# Altium schematic sheet Battery Power.SchDoc
size A4
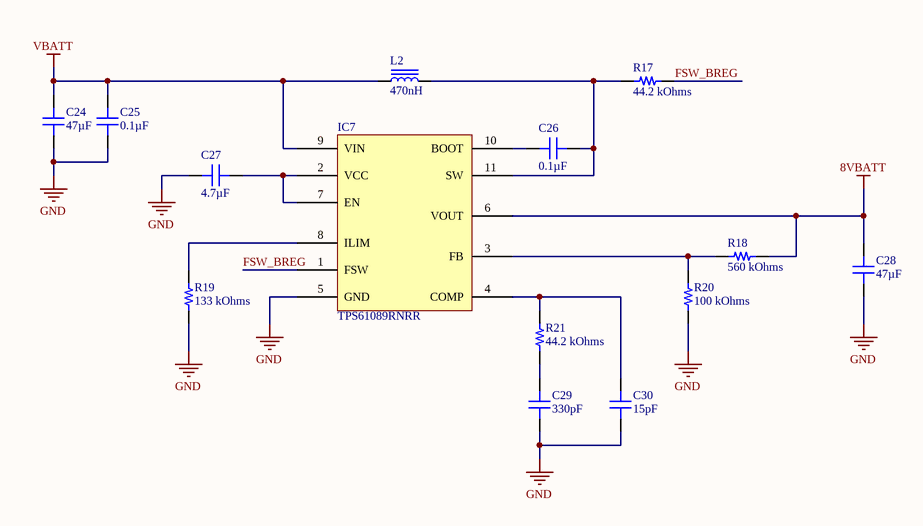
[diagram p0: Battery Power.SchDoc]

## Parts
C24  47µF  [CAP 1210_3225 - 2.8MM]
C25  0.1µF  [CAP 0201_0603]
C26  0.1µF  [CAP 0201_0603]
C27  4.7µF  [CAP 0402_1005]
C28  47µF  [CAP 1210_3225 - 2.8MM]
C29  330pF  [CAP 0201_0603]
C30  15pF  [CAP 0201_0603]
IC7  TPS61089RNRR  [TI VQFN-11 2.5x2.1 RNR]
L2  470nH  [BOURNS SRP5030T]
R17  44.2 kOhms  [RES 0201_0603]
R18  560 kOhms  [RES 0201_0603]
R19  133 kOhms  [RES 0201_0603]
R20  100 kOhms  [RES 0201_0603]
R21  44.2 kOhms  [RES 0201_0603]

## Nets
8VBATT: C28.2 IC7.6(VOUT) R18.1
GND: C24.1 C25.1 C27.1 C28.1 C29.1 C30.1 IC7.5(GND) R19.1 R20.1
VBATT: C24.2 C25.2 IC7.9(VIN) L2.1
FSW_BREG: IC7.1(FSW) R17.2
NetC26_1: C26.1 IC7.11(SW) L2.2 R17.1
NetC26_2: C26.2 IC7.10(BOOT)
NetC27_2: C27.2 IC7.2(VCC) IC7.7(EN)
NetC29_2: C29.2 R21.1
NetC30_2: C30.2 IC7.4(COMP) R21.2
NetIC7_3: IC7.3(FB) R18.2 R20.2
NetIC7_8: IC7.8(ILIM) R19.2

## Notes on the sheet
- Title
- Size:
- Date:
- A4
- Number:
- Time:
- Revision:
- Sheet
- of
- File:

## Library data of the parts
C24 = LMK325B7476MM-PR: CAP CER 47UF 10V X7R 1210; Manufacturer: Taiyo Yuden; Tolerance: ±20%; Part Number: LMK325B7476MM-PR; Value: 47µF; Applications: General Purpose; Capacitance: 47µF; ComponentLink1Description: Datasheet; ComponentLink1URL: https://www.yuden.co.jp/productdata/catalog/mlcc01_e.pdf; ComponentLink2Description: DigiKey Link; ComponentLink2URL: http://digikey.com/product-detail/en/taiyo-yuden/LMK325B7476MM-PR/587-5922-1-ND/7675042; Device Package: 1210 (3225 Metric); LastUpdated: 21/01/2020 00:30:21; Lifecycle Status: Active; Minimum Order: 1; Mounting Type: Surface Mount, MLCC; Operating Temperature: -55°C ~ 125°C; Package / Case: 1210 (3225 Metric); Packaging: TapeAndReel; PartId: 24091; Part Status: Active; Price: 0.28; Series: M; Size / Dimension: 0.126" L x 0.098" W (3.20mm x 2.50mm); Supplier 1: DigiKey; Supplier Part Number 1: 587-5922-1-ND; Temperature Coefficient: X7R; Thickness (Max): 0.106" (2.70mm); Voltage - Rated: 10V
C25 C26 = GRM033R61C104ME84D: CAP CER 0.1UF 16V X5R 0201; Manufacturer: Murata Electronics; Tolerance: ±20%; Part Number: GRM033R61C104ME84D; Value: 0.1µF; Applications: General Purpose; Capacitance: 0.1µF; ComponentLink1Description: Datasheet; ComponentLink1URL: https://search.murata.co.jp/Ceramy/image/img/A01X/G101/ENG/GRM033R61C104ME84-01.pdf; ComponentLink2Description: DigiKey Link; ComponentLink2URL: http://digikey.com/product-detail/en/murata-electronics/GRM033R61C104ME84D/490-9986-1-ND/5026291; Device Package: 0201 (0603 Metric); LastUpdated: 21/01/2020 00:00:12; Lifecycle Status: Active; Minimum Order: 1; Mounting Type: Surface Mount, MLCC; Operating Temperature: -55°C ~ 85°C; Package / Case: 0201 (0603 Metric); Packaging: TapeAndReel; PartId: 1522; Part Status: Active; Price: 0.01; Series: GRM; Size / Dimension: 0.024" L x 0.012" W (0.60mm x 0.30mm); Supplier 1: DigiKey; Supplier Part Number 1: 490-9986-1-ND; Temperature Coefficient: X5R; Thickness (Max): 0.013" (0.33mm); Voltage - Rated: 16V
C27 = CL05A475KP5NRNC: CAP CER 4.7UF 10V X5R 0402; Manufacturer: Samsung Electro-Mechanics; Tolerance: ±10%; Part Number: CL05A475KP5NRNC; Value: 4.7µF; Applications: General Purpose; Capacitance: 4.7µF; ComponentLink1Description: Datasheet; ComponentLink1URL: http://www.samsungsem.com/kr/support/product-search/mlcc/CL05A475KP5NRNC.jsp; ComponentLink2Description: DigiKey Link; ComponentLink2URL: http://digikey.com/product-detail/en/samsung-electro-mechanics/CL05A475KP5NRNC/1276-1480-1-ND/3889566; Device Package: 0402 (1005 Metric); LastUpdated: 01/04/2020 23:57:03; Lifecycle Status: Active; Minimum Order: 1; Mounting Type: Surface Mount, MLCC; Operating Temperature: -55°C ~ 85°C; Package / Case: 0402 (1005 Metric); Packaging: TapeAndReel; PartId: 2191; Part Status: Active; Price: 0.08; Series: CL; Size / Dimension: 0.039" L x 0.020" W (1.00mm x 0.50mm); Supplier 1: DigiKey; Supplier Part Number 1: 1276-1480-1-ND; Temperature Coefficient: X5R; Thickness (Max): 0.022" (0.55mm); Voltage - Rated: 10V
C28 = C1210C476M4PACTU: CAP CER 47UF 16V X5R 1210; Manufacturer: KEMET; Tolerance: ±20%; Part Number: C1210C476M4PACTU; Value: 47µF; Applications: General Purpose; Capacitance: 47µF; ComponentLink1Description: Datasheet; ComponentLink1URL: https://api.kemet.com/component-edge/download/datasheet/C1210C476M4PACTU.pdf; ComponentLink2Description: DigiKey Link; ComponentLink2URL: http://digikey.com/product-detail/en/kemet/C1210C476M4PACTU/399-5514-1-ND/1950692; Device Package: 1210 (3225 Metric); LastUpdated: 21/01/2020 00:30:39; Lifecycle Status: Active; Minimum Order: 1; Mounting Type: Surface Mount, MLCC; Operating Temperature: -55°C ~ 85°C; Package / Case: 1210 (3225 Metric); Packaging: TapeAndReel; PartId: 23816; Part Status: Active; Price: 0.38; Series: SMD Comm X5R; Size / Dimension: 0.126" L x 0.098" W (3.20mm x 2.50mm); Supplier 1: DigiKey; Supplier Part Number 1: 399-5514-1-ND; Temperature Coefficient: X5R; Thickness (Max): 0.110" (2.80mm); Voltage - Rated: 16V
C29 = CL03B331KA3NNNC: CAP CER 330PF 25V X7R 0201; Manufacturer: Samsung Electro-Mechanics; Tolerance: ±10%; Part Number: CL03B331KA3NNNC; Value: 330pF; Applications: General Purpose; Capacitance: 330pF; ComponentLink1Description: Datasheet; ComponentLink1URL: http://www.samsungsem.com/kr/support/product-search/mlcc/CL03B331KA3NNNC.jsp; ComponentLink2Description: DigiKey Link; ComponentLink2URL: http://digikey.com/product-detail/en/samsung-electro-mechanics/CL03B331KA3NNNC/1276-1351-1-ND/3889437; Device Package: 0201 (0603 Metric); LastUpdated: 21/01/2020 00:00:16; Lifecycle Status: Active; Minimum Order: 1; Mounting Type: Surface Mount, MLCC; Operating Temperature: -55°C ~ 125°C; Package / Case: 0201 (0603 Metric); Packaging: TapeAndReel; PartId: 781; Part Status: Active; Price: 0.01; Series: CL; Size / Dimension: 0.024" L x 0.012" W (0.60mm x 0.30mm); Supplier 1: DigiKey; Supplier Part Number 1: 1276-1351-1-ND; Temperature Coefficient: X7R; Thickness (Max): 0.013" (0.33mm); Voltage - Rated: 25V
C30 = CGA1A2C0G1E150J030BA: CAP CER 15PF 25V C0G 0201; Manufacturer: TDK Corporation; Temperature Coefficient: C0G, NP0; Tolerance: ±5%; Part Number: CGA1A2C0G1E150J030BA; Value: 15pF; Applications: Automotive; Capacitance: 15pF; ComponentLink1Description: Datasheet; ComponentLink1URL: https://product.tdk.com/info/en/catalog/datasheets/mlcc_automotive_general_en.pdf?ref_disty=digikey; ComponentLink2Description: DigiKey Link; ComponentLink2URL: http://digikey.com/product-detail/en/tdk-corporation/CGA1A2C0G1E150J030BA/445-9034-1-ND/3648614; Device Package: 0201 (0603 Metric); LastUpdated: 21/01/2020 00:00:11; Lifecycle Status: Active; Minimum Order: 1; Mounting Type: Surface Mount, MLCC; Operating Temperature: -55°C ~ 125°C; Package / Case: 0201 (0603 Metric); Packaging: TapeAndReel; PartId: 1675; Part Status: Active; Price: 0.01; Ratings: AEC-Q200; Series: CGA; Size / Dimension: 0.024" L x 0.012" W (0.60mm x 0.30mm); Supplier 1: DigiKey; Supplier Part Number 1: 445-9034-1-ND; Thickness (Max): 0.013" (0.33mm); Voltage - Rated: 25V
IC7 = TPS61089RNRR: IC REG BOOST ADJ 7A 11VQFN; Manufacturer: Texas Instruments; Frequency - Switching: 200kHz ~ 2.2MHz; Function: Step-Up; Number of Outputs: 1; Output Configuration: Positive; Output Type: Adjustable; Synchronous Rectifier: Yes; Voltage - Input (Max): 12V; Voltage - Input (Min): 2.7V; Voltage - Output (Max): 12.6V; Voltage - Output (Min/Fixed): 4.5V; Part Number: TPS61089RNRR; ComponentLink1Description: Datasheet; ComponentLink1URL: http://www.ti.com/general/docs/suppproductinfo.tsp?distId=10&gotoUrl=http%3A%2F%2Fwww.ti.com%2Flit%2Fgpn%2Ftps61089; ComponentLink2Description: DigiKey Link; ComponentLink2URL: http://digikey.com/product-detail/en/texas-instruments/TPS61089RNRR/296-47295-1-ND/7688305; Current - Output: 7A; Device Package: 11-VFQFN; LastUpdated: 05/04/2020 02:30:28; Lifecycle Status: Active; Minimum Order: 1; Mounting Type: Surface Mount; Operating Temperature: -40°C ~ 125°C (TJ); Package / Case: 11-VFQFN; Packaging: TapeAndReel; Part Status: Active; Price: 1.26; Series: -; Supplier 1: DigiKey; Supplier Part Number 1: 296-47295-1-ND; Supplier Device Package: 11-VQFN-HR (2.5x2); Topology: Boost
L2 = SRP5030T-R47M: FIXED IND 470NH 12A 7.4 MOHM SMD; Manufacturer: Bourns Inc.; Current - Saturation: 16A; DC Resistance (DCR): 7.4mOhm Max; Inductance Frequency - Test: 100kHz; Material - Core: Iron Powder; Shielding: Shielded; Tolerance: ±20%; Type: Wirewound; Part Number: SRP5030T-R47M; ComponentLink1Description: Datasheet; ComponentLink1URL: https://www.bourns.com/docs/Product-Datasheets/SRP5030T.pdf; ComponentLink2Description: DigiKey Link; ComponentLink2URL: http://digikey.com/product-detail/en/bourns-inc/SRP5030T-R47M/SRP5030T-R47MCT-ND/3986019; Current Rating (Amps): 12A; Device Package: Nonstandard; Height - Seated (Max): 0.118" (3.00mm); Inductance: 470nH; LastUpdated: 21/01/2020 03:25:23; Lifecycle Status: Active; Minimum Order: 1; Mounting Type: Surface Mount; Operating Temperature: -40°C ~ 125°C; Package / Case: Nonstandard; Packaging: TapeAndReel; PartId: 5; Part Status: Active; Price: 0.66; Series: SRP5030T; Size / Dimension: 0.224" L x 0.205" W (5.70mm x 5.20mm); Supplier 1: DigiKey; Supplier Part Number 1: SRP5030T-R47MCT-ND; Value: 470nH
R17 R21 = ERJ-1GNF4422C: RES SMD 44.2K OHM 1% 1/20W 0201; Manufacturer: Panasonic Electronic Components; Power (Watts): 0.05W, 1/20W; Temperature Coefficient: ±200ppm/°C; Part Number: ERJ-1GNF4422C; Value: 44.2 kOhms; ComponentLink1Description: Datasheet; ComponentLink1URL: https://industrial.panasonic.com/cdbs/www-data/pdf/RDA0000/AOA0000C304.pdf; ComponentLink2Description: DigiKey Link; ComponentLink2URL: http://digikey.com/product-detail/en/panasonic-electronic-components/ERJ-1GNF4422C/P123017CT-ND/8342973; Composition: Thick Film; Device Package: 0201 (0603 Metric); Features: Automotive AEC-Q200; Height - Seated (Max): 0.010" (0.26mm); LastUpdated: 21/01/2020 00:04:13; Lifecycle Status: Active; Minimum Order: 1; Number of Terminations: 2; Operating Temperature: -55°C ~ 125°C; Package / Case: 0201 (0603 Metric); Packaging: TapeAndReel; PartId: 2403; Part Status: Active; Price: 0.01; Ratings: AEC-Q200; Resistance: 44.2 kOhms; Series: ERJ; Size / Dimension: 0.024" L x 0.012" W (0.60mm x 0.30mm); Supplier 1: DigiKey; Supplier Part Number 1: P123017CT-ND; Supplier Device Package: 0201; Tolerance: ±1%
R18 = ERJ-1GNF5603C: RES SMD 560K OHM 1% 1/20W 0201; Manufacturer: Panasonic Electronic Components; Power (Watts): 0.05W, 1/20W; Temperature Coefficient: ±200ppm/°C; Part Number: ERJ-1GNF5603C; Value: 560 kOhms; ComponentLink1Description: Datasheet; ComponentLink1URL: https://industrial.panasonic.com/cdbs/www-data/pdf/RDA0000/AOA0000C304.pdf; ComponentLink2Description: DigiKey Link; ComponentLink2URL: http://digikey.com/product-detail/en/panasonic-electronic-components/ERJ-1GNF5603C/P123077CT-ND/8343093; Composition: Thick Film; Device Package: 0201 (0603 Metric); Features: Automotive AEC-Q200; Height - Seated (Max): 0.010" (0.26mm); LastUpdated: 21/01/2020 00:04:10; Lifecycle Status: Active; Minimum Order: 1; Number of Terminations: 2; Operating Temperature: -55°C ~ 125°C; Package / Case: 0201 (0603 Metric); Packaging: TapeAndReel; PartId: 4184; Part Status: Active; Price: 0.01; Ratings: AEC-Q200; Resistance: 560 kOhms; Series: ERJ; Size / Dimension: 0.024" L x 0.012" W (0.60mm x 0.30mm); Supplier 1: DigiKey; Supplier Part Number 1: P123077CT-ND; Supplier Device Package: 0201; Tolerance: ±1%
R19 = ERJ-1GNF1333C: RES SMD 133K OHM 1% 1/20W 0201; Manufacturer: Panasonic Electronic Components; Power (Watts): 0.05W, 1/20W; Temperature Coefficient: ±200ppm/°C; Part Number: ERJ-1GNF1333C; Value: 133 kOhms; ComponentLink1Description: Datasheet; ComponentLink1URL: https://industrial.panasonic.com/cdbs/www-data/pdf/RDA0000/AOA0000C304.pdf; ComponentLink2Description: DigiKey Link; ComponentLink2URL: http://digikey.com/product-detail/en/panasonic-electronic-components/ERJ-1GNF1333C/P122719CT-ND/8342377; Composition: Thick Film; Device Package: 0201 (0603 Metric); Features: Automotive AEC-Q200; Height - Seated (Max): 0.010" (0.26mm); LastUpdated: 21/01/2020 00:04:13; Lifecycle Status: Active; Minimum Order: 1; Number of Terminations: 2; Operating Temperature: -55°C ~ 125°C; Package / Case: 0201 (0603 Metric); Packaging: TapeAndReel; PartId: 2343; Part Status: Active; Price: 0.01; Ratings: AEC-Q200; Resistance: 133 kOhms; Series: ERJ; Size / Dimension: 0.024" L x 0.012" W (0.60mm x 0.30mm); Supplier 1: DigiKey; Supplier Part Number 1: P122719CT-ND; Supplier Device Package: 0201; Tolerance: ±1%
R20 = ERJ-1GNF1003C: RES SMD 100K OHM 1% 1/20W 0201; Manufacturer: Panasonic Electronic Components; Power (Watts): 0.05W, 1/20W; Temperature Coefficient: ±200ppm/°C; Part Number: ERJ-1GNF1003C; Value: 100 kOhms; ComponentLink1Description: Datasheet; ComponentLink1URL: https://industrial.panasonic.com/cdbs/www-data/pdf/RDA0000/AOA0000C304.pdf; ComponentLink2Description: DigiKey Link; ComponentLink2URL: http://digikey.com/product-detail/en/panasonic-electronic-components/ERJ-1GNF1003C/P122655CT-ND/8342249; Composition: Thick Film; Device Package: 0201 (0603 Metric); Features: Automotive AEC-Q200; Height - Seated (Max): 0.010" (0.26mm); LastUpdated: 21/01/2020 00:04:18; Lifecycle Status: Active; Minimum Order: 1; Number of Terminations: 2; Operating Temperature: -55°C ~ 125°C; Package / Case: 0201 (0603 Metric); Packaging: TapeAndReel; PartId: 819; Part Status: Active; Price: 0.01; Ratings: AEC-Q200; Resistance: 100 kOhms; Series: ERJ; Size / Dimension: 0.024" L x 0.012" W (0.60mm x 0.30mm); Supplier 1: DigiKey; Supplier Part Number 1: P122655CT-ND; Supplier Device Package: 0201; Tolerance: ±1%